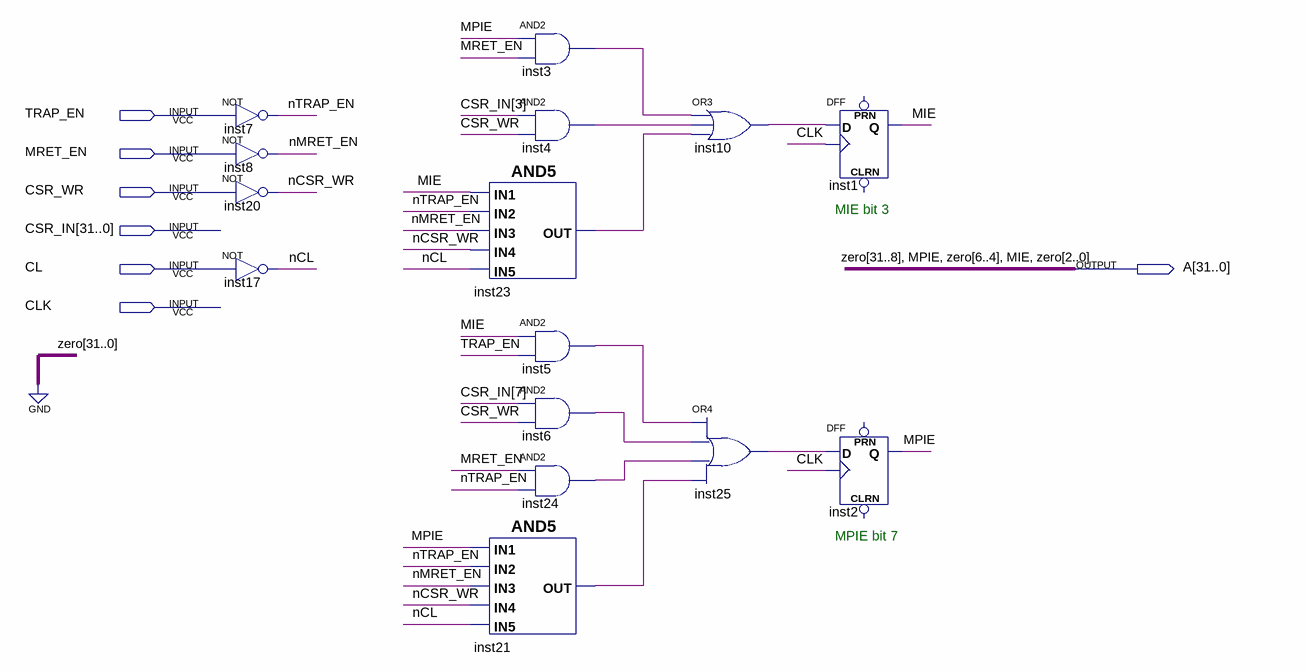
[diagram p0: schematic sheet]
// Quartus schematic mstatus.bdf as structural Verilog: 15 symbols, 7 pins
module mstatus (
  input  TRAP_EN,
  input  MRET_EN,
  input  CSR_WR,
  input  [31:0] CSR_IN,
  input  CL,
  input  CLK,
  output [31:0] A
);

  wire inst3_out, inst4_out, inst5_out, inst6_out, inst10_out, inst21_out, inst23_out, inst24_out,
       inst25_out, nCL, nCSR_WR, nMRET_EN, nTRAP_EN;

  not inst7 (nTRAP_EN, TRAP_EN);
  not inst8 (nMRET_EN, MRET_EN);
  not inst20 (nCSR_WR, CSR_WR);
  not inst17 (nCL, CL);
  and inst3 (inst3_out, A[7], MRET_EN);
  and inst4 (inst4_out, CSR_IN[3], CSR_WR);
  and inst23 (inst23_out, A[3], nTRAP_EN, nMRET_EN, nCSR_WR, nCL);
  and inst5 (inst5_out, A[3], TRAP_EN);
  and inst6 (inst6_out, CSR_IN[7], CSR_WR);
  and inst24 (inst24_out, MRET_EN, nTRAP_EN);
  and inst21 (inst21_out, A[7], nTRAP_EN, nMRET_EN, nCSR_WR, nCL);
  or inst10 (inst10_out, inst3_out, inst4_out, inst23_out);
  or inst25 (inst25_out, inst5_out, inst6_out, inst24_out, inst21_out);
  DFF inst1 (.CLK(CLK), .D(inst10_out), .Q(A[3]));  // open: CLRN, PRN
  DFF inst2 (.CLK(CLK), .D(inst25_out), .Q(A[7]));  // open: CLRN, PRN

  assign {A[31:8], A[6:4], A[2:0]} = {30{1'b0}};

  // Other names for the same wires on the sheet: MIE = A[3]; MPIE = A[7]

  // Notes on the sheet:
  //   MIE bit 3
  //   MPIE bit 7
endmodule
